# Altium project FSAE Composite Oven Controller.PrjPcb
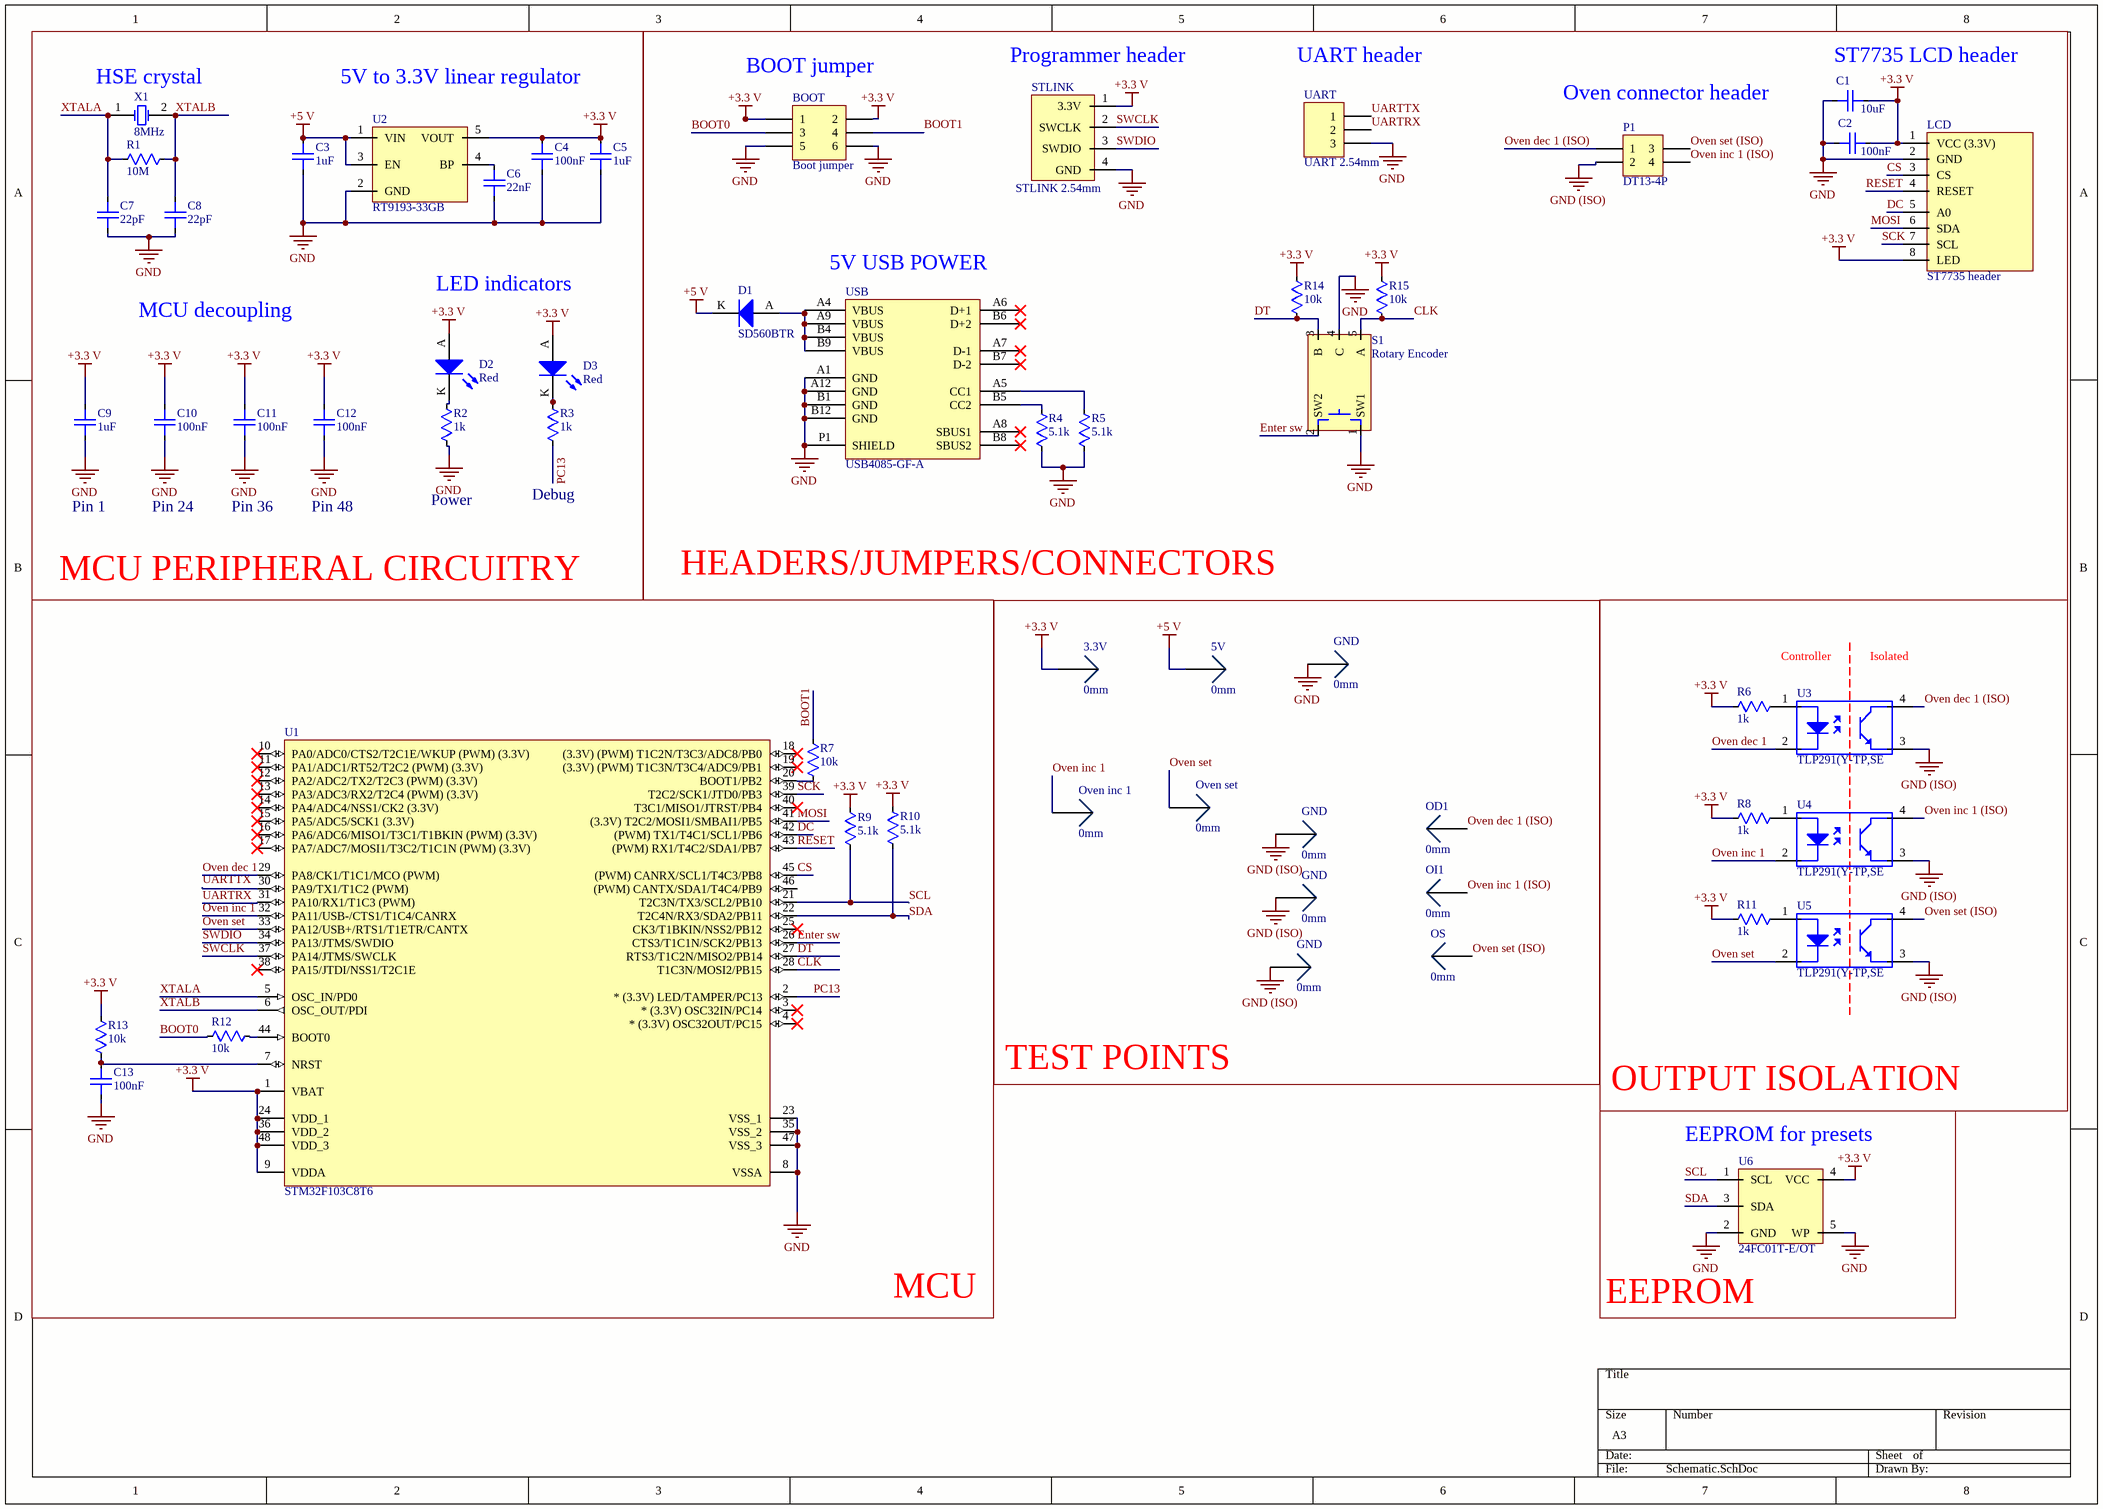
[diagram p0: Schematic.SchDoc]
1 sheet, 56 parts. Net scope: global (net labels, ports and power ports of the same name join across sheets).
Board file: Oven Controller.PcbDoc

## Sheet Schematic.SchDoc
size A3; SheetNumber: 1; SheetTotal: 1

### Parts
(Parts that share a designator on the sheet are numbered #1, #2 ... from top to bottom, then left to right.)
3.3V  0mm  [SMD Test Point]
5V  0mm  [SMD Test Point]
BOOT  Boot jumper  [TH 2.54mm Header 2x3]
C1  10uF  [0805]
C2  100nF  [0805]
C3  1uF  [0805]
C4  100nF  [0805]
C5  1uF  [0805]
C6  22nF  [0805]
C7  22pF  [0805]
C8  22pF  [0805]
C9  1uF  [0805]
C10  100nF  [0805]
C11  100nF  [0805]
C12  100nF  [0805]
C13  100nF  [0805]
D1  SD560BTR  [SMB Diode]
D2  Red  [0805 LED]
D3  Red  [0805 LED]
GND#1  0mm  [SMD Test Point]
GND#2  0mm  [SMD Test Point]
GND#3  0mm  [SMD Test Point]
GND#4  0mm  [SMD Test Point]
LCD  ST7735 header  [TH 2.54mm Header 1x8]
OD1  0mm  [SMD Test Point]
OI1  0mm  [SMD Test Point]
OS  0mm  [SMD Test Point]
Oven_inc_1  0mm  [SMD Test Point]
Oven_set  0mm  [SMD Test Point]
P1  DT13-4P  [DT13-4P]
R1  10M  [0805]
R2  1k  [0805]
R3  1k  [0805]
R4  5.1k  [0805]
R5  5.1k  [0805]
R6  1k  [0805]
R7  10k  [0805]
R8  1k  [0805]
R9  5.1k  [0805]
R10  5.1k  [0805]
R11  1k  [0805]
R12  10k  [0805]
R13  10k  [0805]
R14  10k  [0805]
R15  10k  [0805]
S1  Rotary Encoder  [Rotary Encoder]
STLINK  STLINK 2.54mm  [TH 2.54mm Header 1x4]
U1  STM32F103C8T6  [STM 48-LQFP]
U2  RT9193-33GB  [SOT23-5 IPC]
U3  TLP291(Y-TP,SE  [SOIC-4 (4.55mm width)]
U4  TLP291(Y-TP,SE  [SOIC-4 (4.55mm width)]
U5  TLP291(Y-TP,SE  [SOIC-4 (4.55mm width)]
U6  24FC01T-E/OT  [SOT23-5 IPC]
UART  UART 2.54mm  [TH 2.54mm Header 1x3]
USB  USB4085-GF-A  [USB4085-GF-A]
X1  8MHz  [Abracon HC-49/US]

### Blocks framed on the sheet
MCU PERIPHERAL CIRCUITRY: C3-C12 D2 D3 R1-R3 U2 X1
HEADERS/JUMPERS/CONNECTORS: BOOT C1 C2 D1 LCD P1 R4 R5 R14 R15 S1 STLINK UART USB
TEST POINTS: 3.3V 5V GND#1-GND#4 OD1 OI1 OS Oven_inc_1 Oven_set
OUTPUT ISOLATION: R6 R8 R11 U3-U5

### Nets
+3.3 V: 3.3V.1 BOOT.1 BOOT.2 C1.2 C2.1 C4.1 C5.1 C9.2 C10.1 C11.1 C12.1 D2.A D3.A LCD.1(VCC_(3.3V)) LCD.8(LED) R6.1 R8.1 R9.2 R10.2 R11.1 R13.1 R14.2 R15.1 STLINK.1(3.3V) U1.1(VBAT) U1.9(VDDA) U1.24(VDD_1) U1.36(VDD_2) U1.48(VDD_3) U2.5(VOUT) U6.4(VCC)
+5 V: 5V.1 C3.2 D1.K U2.1(VIN) U2.3(EN)
GND: BOOT.5 BOOT.6 C1.1 C2.2 C3.1 C4.2 C5.2 C6.2 C7.2 C8.2 C9.1 C10.2 C11.2 C12.2 C13.2 GND#1.1 LCD.2(GND) R2.1 R4.1 R5.1 S1.1(SW1) S1.4(C) STLINK.4(GND) U1.8(VSSA) U1.23(VSS_1) U1.35(VSS_2) U1.47(VSS_3) U2.2(GND) U6.2(GND) U6.5(WP) UART.3 USB.A1(GND) USB.A12(GND) USB.B1(GND) USB.B12(GND) USB.P1(SHIELD)
GND (ISO): GND#2.1 GND#3.1 GND#4.1 P1.2 U3.3(Emitter) U4.3(Emitter) U5.3(Emitter)
BOOT0: BOOT.3 R12.1
BOOT1: BOOT.4 R7.1
CLK: R15.2 S1.5(A) U1.28(T1C3N/MOSI2/PB15)
CS: LCD.3(CS) U1.45((PWM)_CANRX/SCL1/T4C3/PB8)
DC: LCD.5(A0) U1.42((PWM)_TX1/T4C1/SCL1/PB6)
DT: R14.1 S1.3(B) U1.27(RTS3/T1C2N/MISO2/PB14)
Enter sw: S1.2(SW2) U1.26(CTS3/T1C1N/SCK2/PB13)
MOSI: LCD.6(SDA) U1.41((3.3V)_T2C2/MOSI1/SMBAI1/PB5)
Oven dec 1: U1.29(PA8/CK1/T1C1/MCO_(PWM)) U3.2(Cathode)
Oven dec 1 (ISO): OD1.1 P1.1 U3.4(Collector)
Oven inc 1: Oven_inc_1.1 U1.32(PA11/USB-/CTS1/T1C4/CANRX) U4.2(Cathode)
Oven inc 1 (ISO): OI1.1 P1.4 U4.4(Collector)
Oven set: Oven_set.1 U1.33(PA12/USB+/RTS1/T1ETR/CANTX) U5.2(Cathode)
Oven set (ISO): OS.1 P1.3 U5.4(Collector)
PC13: R3.1 U1.2(*_(3.3V)_LED/TAMPER/PC13)
RESET: LCD.4(RESET) U1.43((PWM)_RX1/T4C2/SDA1/PB7)
SCK: LCD.7(SCL) U1.39(T2C2/SCK1/JTD0/PB3)
SCL: R9.1 U1.21(T2C3N/TX3/SCL2/PB10) U6.1(SCL)
SDA: R10.1 U1.22(T2C4N/RX3/SDA2/PB11) U6.3(SDA)
SWCLK: STLINK.2(SWCLK) U1.37(PA14/JTMS/SWCLK)
SWDIO: STLINK.3(SWDIO) U1.34(PA13/JTMS/SWDIO)
UARTRX: U1.31(PA10/RX1/T1C3_(PWM)) UART.2
UARTTX: U1.30(PA9/TX1/T1C2_(PWM)) UART.1
XTALA: C7.1 R1.1 U1.5(OSC_IN/PD0) X1.1(OSC1)
XTALB: C8.1 R1.2 U1.6(OSC_OUT/PDI) X1.2(OSC2)
NetC6_1: C6.1 U2.4(BP)
NetC13_1: C13.1 R13.2 U1.7(NRST)
NetD1_A: D1.A USB.A4(VBUS) USB.A9(VBUS) USB.B4(VBUS) USB.B9(VBUS)
NetD2_K: D2.K R2.2
NetD3_K: D3.K R3.2
NetR4_2: R4.2 USB.B5(CC2)
NetR5_2: R5.2 USB.A5(CC1)
NetR6_2: R6.2 U3.1(Anode)
NetR7_2: R7.2 U1.20(BOOT1/PB2)
NetR8_2: R8.2 U4.1(Anode)
NetR11_2: R11.2 U5.1(Anode)
NetR12_2: R12.2 U1.44(BOOT0)

Not connected (* = marked no-connect by the designer): U1 3(*_(3.3V)_OSC32IN/PC14)* 4(*_(3.3V)_OSC32OUT/PC15)* 10(PA0/ADC0/CTS2/T2C1E/WKUP_(PWM)_(3.3V))* 11(PA1/ADC1/RT52/T2C2_(PWM)_(3.3V))* 12(PA2/ADC2/TX2/T2C3_(PWM)_(3.3V))* 13(PA3/ADC3/RX2/T2C4_(PWM)_(3.3V))* 14(PA4/ADC4/NSS1/CK2_(3.3V))* 15(PA5/ADC5/SCK1_(3.3V))* 16(PA6/ADC6/MISO1/T3C1/T1BKIN_(PWM)_(3.3V))* 17(PA7/ADC7/MOSI1/T3C2/T1C1N_(PWM)_(3.3V))* 18((3.3V)_(PWM)_T1C2N/T3C3/ADC8/PB0)* 19((3.3V)_(PWM)_T1C3N/T3C4/ADC9/PB1)* 25(CK3/T1BKIN/NSS2/PB12)* 38(PA15/JTDI/NSS1/T2C1E)* 40(T3C1/MISO1/JTRST/PB4)* 46((PWM)_CANTX/SDA1/T4C4/PB9); USB A6(D+1)* A7(D-1)* A8(SBUS1)* B6(D+2)* B7(D-2)* B8(SBUS2)*

### Notes on the sheet
- (near X1) HSE crystal
- 5V to 3.3V linear regulator
- (near BOOT) BOOT jumper
- (near STLINK) Programmer header
- (near UART) UART header
- Oven connector header
- (near C1) ST7735 LCD header
- LED indicators
- (near USB) 5V USB POWER
- MCU decoupling
- Pin 1
- Pin 24
- Pin 36
- Pin 48
- (near R2) Power
- (near R3) Debug
- Controller             Isolated
- (near U6) EEPROM for presets
- MCU
- (near U6) EEPROM

### Library data of the parts
3.3V 5V GND#1-GND#4 OD1 OI1 OS Oven_inc_1 Oven_set = Test Point
BOOT = Header 2x3
C1-C13 = Capacitor
D1 = SD560BTR: 1.2V_F 600V 5A SMB; Manufacturer: SMC Diode Solutions; Part Number: SD560BTR; Digikey Part Number: 1655-1530-2-ND; Digikey Link: https://www.digikey.com/product-detail/en/smc-diode-solutions/SD560BTR/1655-1530-2-ND/6022620; Supplier Part Number 1: 1655-1530-2-ND
D2 D3 = SML-210LTT86: Red LED Indication - Discrete 1.75V 0805 (2012 Metric); Manufacturer: ROHM Semiconductor; Part Number: SML-210LTT86; Colour: Red; Digikey Part Number: 511-1286-1-ND; Digikey Link: https://www.digikey.com/product-detail/en/rohm-semiconductor/SML-210LTT86/511-1286-1-ND/637099
  D2: Supplier Part Number 1: 511-1286-1-ND
LCD = ST7735 LCD 1x8: Header for the ST7735 LCD module; Category: Connectors; Supplier 1: Digi-Key; Supplier Part Number 1: 1528-1536-ND
R1-R15 = Resistor
STLINK = STLINK 1x4: Header used for the STLINK programmer; Category: Connectors
U1 = STM32F103C8T6: ARM® Cortex®-M3 STM32F1 Microcontroller IC 32-Bit 72MHz 64KB (64K x 8) FLASH; Manufacturer: STMicroelectronics; Part Number: STM32F103C8T6; Digikey Part Number: 497-6063-ND; Digikey Link: https://www.digikey.com/product-detail/en/stmicroelectronics/STM32F103C8T6/497-6063-ND/1646338; Supplier 1: Digi-Key; Supplier Part Number 1: 497-6063-ND
U2 = RT9193: Voltage: 3.3V; Supplier 1: Digi-Key; Supplier Part Number 1: 1028-1014-1-ND
U3-U5 = TLP291: Supplier 1: Digi-Key; Supplier Part Number 1: TLP291(Y-TPSECT-ND
U6 = 24FC01: I2C EEPROM; Manufacturer: Microchip Technology; Qualifications: AEC-Q-100; Memory: 128 Bytes; Max speed: 1 MHz; Category: Integrated Circuits; Part number: 24FC01T-E/OT; Package: SOT23-5; Function: EEPROM; Protocol: I2C; Digikey part number: 24FC01T-E/OTCT-ND; Digikey link: https://www.digikey.com.au/en/products/detail/microchip-technology/24FC01T-E-OT/9996239; Supplier 1: Digi-Key; Supplier Part Number 1: 24FC01T-E/OTCT-ND
UART = Header 1x3
X1 = ABLS-8.000MHZ-B4-T: Manufacturer: Abracon LLC; Load Capacitance: 18pF; ESR: 80R; Part Number: ABLS-8.000MHZ-B4-T; Value: 8MHz; Digikey Part Number: 535-10212-2-ND; Digikey Link: https://www.digikey.com/product-detail/en/abracon-llc/ABLS-8.000MHZ-B4-T/535-10212-2-ND/2184155; Supplier 1: Digi-Key; Supplier Part Number 1: 535-10212-2-ND
S1 = Rotary Encoder: Supplier 1: Digi-Key; Supplier Part Number 1: PEC11R-4220K-S0024-ND